# Altium project Twomes_Monitor_master.PrjPCB
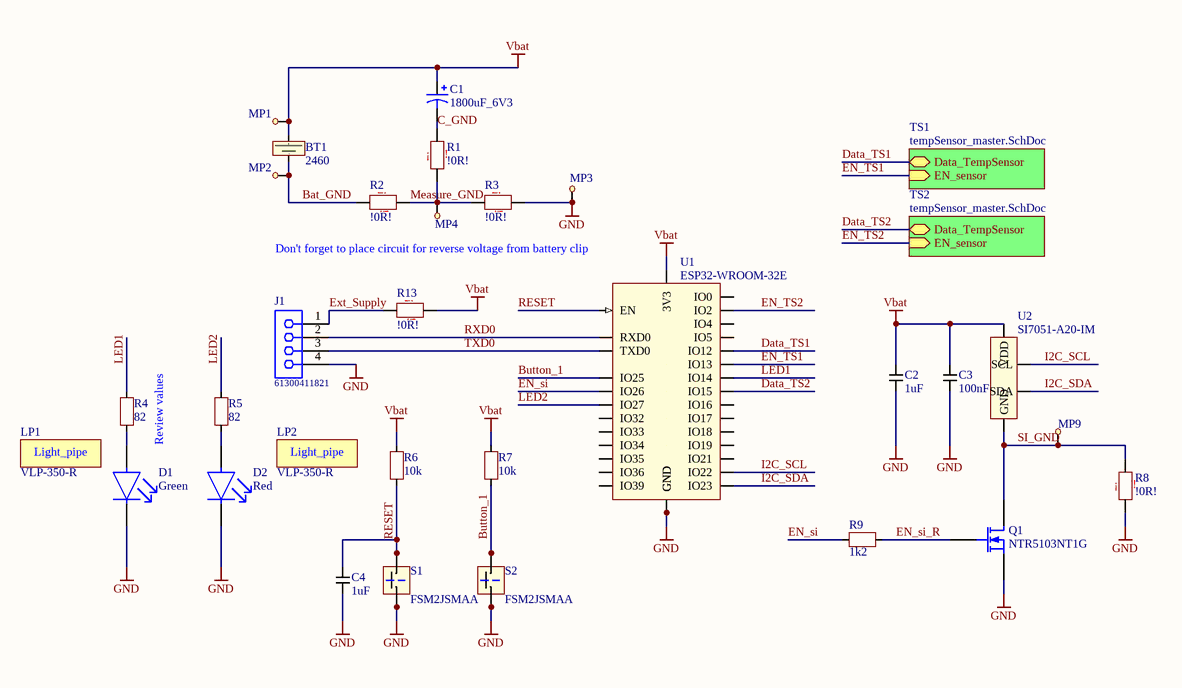
[diagram p0: main_master.SchDoc]
2 sheets, 44 parts. Net scope: hierarchical (ports join the sheet entries above them; power ports are global).
Board file: Twomes_Monitor_master.PcbDoc
Sheets:
  main_master.SchDoc
    TS1 = tempSensor_master.SchDoc
    TS2 = tempSensor_master.SchDoc

## Sheet main_master.SchDoc
size A4

### Parts
BT1  2460  [KEYSTONE_2410]
C1  1800uF_6V3  [CAPAE109103X105M]
C2  1uF  [C1206]
C3  100nF  [C1206]
C4  1uF  [C1206]
D1  Green  [Kingbright_KPT-2012EC_0]
D2  Red  [Kingbright_KPT-2012EC_0]
J1  61300411821  [61300411821]
LP1  VLP-350-R  [VLP-350-R]
LP2  VLP-350-R  [VLP-350-R]
MP1  Measure_point  [MeasurePoint_1.5mm]  (value not drawn)  (no BOM)
MP2  Measure_point  [MeasurePoint_1.5mm]  (value not drawn)  (no BOM)
MP3  Measure_point  [MeasurePoint_1.5mm]  (value not drawn)  (no BOM)
MP4  Measure_point  [MeasurePoint_1.5mm]  (value not drawn)  (no BOM)
MP9  Measure_point  [MeasurePoint_1.5mm]  (value not drawn)  (no BOM)
Q1  NTR5103NT1G  [SOT23]
R1  !0R!  [R1206_Simple-Assemble]  (no BOM)
R2  !0R!  [R1206_Simple-Assemble]  (no BOM)
R3  !0R!  [R1206_Simple-Assemble]  (no BOM)
R4  82  [R1206_Simple-Assemble]
R5  82  [R1206_Simple-Assemble]
R6  10k  [R1206_Simple-Assemble]
R7  10k  [R1206_Simple-Assemble]
R8  !0R!  [R1206_Simple-Assemble]  (no BOM)
R9  1k2  [R1206_Simple-Assemble]
R13  !0R!  [R1206_Simple-Assemble]  (no BOM)
S1  FSM2JSMAA  [FP-FSM2JSMAA-MFG]
S2  FSM2JSMAA  [FP-FSM2JSMAA-MFG]
U1  ESP32-WROOM-32E  [ESP32­WROOM­32E]
U2  SI7051-A20-IM  [3x3 6-pin DFN]

### Sub-sheets
TS1 = tempSensor_master.SchDoc: Data_TempSensor (bidir), EN_sensor (in)
TS2 = tempSensor_master.SchDoc: Data_TempSensor (bidir), EN_sensor (in)

### Nets
GND: C2.1 C3.1 C4.1 D1.1(C) D2.1(C) J1.4 MP3.1 Q1.2(S) R3.2 R8.1 S1.1(a) S1.3(c) S2.1(a) S2.3(c) U1.1(GND) U1.15(GND) U1.38(GND)
Vbat: BT1.1(+) C1.1 C2.2 C3.2 MP1.1 R6.2 R7.2 R13.2 U1.2(3V3) U2.5(VDD)
Bat_GND: BT1.2(-) MP2.1 R2.1
Button_1: R7.1 S2.2(b) S2.4(d) U1.10(IO25)
C_GND: C1.2 R1.2
Data_TS1: U1.14(IO12) ; sheet TS1/Data_TempSensor
Data_TS2: U1.23(IO15) ; sheet TS2/Data_TempSensor
EN_si: R9.1 U1.11(IO26)
EN_si_R: Q1.1(G) R9.2
EN_TS1: U1.16(IO13) ; sheet TS1/EN_sensor
EN_TS2: U1.24(IO2) ; sheet TS2/EN_sensor
Ext_Supply: J1.1 R13.1
I2C_SCL: U1.36(IO22) U2.6(SCL)
I2C_SDA: U1.37(IO23) U2.1(SDA)
LED1: R4.2 U1.13(IO14)
LED2: R5.2 U1.12(IO27)
Measure_GND: MP4.1 R1.1 R2.2 R3.1
RESET: C4.2 R6.1 S1.2(b) S1.4(d) U1.3(EN)
RXD0: J1.2 U1.34(RXD0)
SI_GND: MP9.1 Q1.3(D) R8.2 U2.2(GND)
TXD0: J1.3 U1.35(TXD0)
NetD1_2: D1.2(A) R4.1
NetD2_2: D2.2(A) R5.1

Not connected (* = marked no-connect by the designer): U1 4(IO36) 5(IO39) 6(IO34) 7(IO35) 8(IO32) 9(IO33) 17(NC) 18(NC) 19(NC) 20(NC) 21(NC) 22(NC) 25(IO0) 26(IO4) 27(IO16) 28(IO17) 29(IO5) 30(IO18) 31(IO19) 32(NC) 33(IO21)

### Notes on the sheet
- Don't forget to place circuit for reverse voltage from battery clip
- Review values
- (in symbol 0R, optional resistor) !
- (in symbol VLP-350-R) Light_pipe

### Library data of the parts
BT1 = 2460: Battery Holder, AA x 1, Through Hole; Brand: KEYSTONE; Farnell_Price: 1,80; Type: 2460; Farnell_Order_Code: 1702629; Mouser_Price: 1,10; Mouser_Order_Code: 534-2460
C1 = 1800uF_6V3: SMD Aluminium Electrolytic Capacitor, Radial Can, 1800 µF, 10 V, 0.092 ohm, TRV Series; Manufacturer Part Number: EEE-FN0J182UV; Manufacturer: Panasonic; Capacitance: 1.8mF; Voltage Rating: 10V; Value: 1800uF; Supplier Unit Price 1: €0.98708; Supplier Part Number 1: 667-EEE-FN0J182UV; Supplier 1: Mouser; Mount: Surface Mount; Category: Aluminum Electrolytic Capacitors
C2 C4 = 1uF,1206: 1uF, 1206; Capacitance: 1uF; Brand: *; Order Code: *; Type: *
C3 = 100nF,1206: 100nF, 1206; Capacitance: 100nF; Brand: *; Order Code: *; Type: *
D1 = AP2012MGC: Standard LEDs - SMD GRN WATER CLEAR 0805; Manufacturer: Kingbright; Forward Current: 20mA; Forward Voltage: 2.1V; Case/Package: 0805; Category: LEDs; Color: Green; Manufacturer Part Number: AP2012MGC; Supplier 1: Mouser; Supplier Part Number 1: 604-AP2012MGC
D2 = KPT-2012EC: KPT-2012EC -  LED, Low Power, Red, SMD, 0805 [2012 Metric], 30 mA, 2 V, 617 nm; Brand: KINGBRIGHT; Order Code: 2099236; Type: KPT-2012EC; Supplier: Farnell; Price: 0,112
J1 = 61300411821: THT Vertical Socket Header WR-PHD, Pitch 2.54 mm, Single Row, 4 pins; Pin Number: 4; Pitch: 2.54 mm; Gender: Female; Rated Current: 3 A; Working Voltage: 250 VAC; Withstanding Voltage: 500 VAC; Contact Resistance: 20 mOhm; ComponentLink1Description: Manufacturer; ComponentLink1URL: http://www.we-online.de; ComponentLink2Description: Datasheet; ComponentLink2URL: https://katalog.we-online.de/em/datasheet/6130xx11821.pdf; Part Number: 61300411821; Published Date: August 2018; Publisher: Wurth Elektronik; Operating Temperature: -40 to 125 degC; Mounting Technology: THT; Packaging: Tray; Row Number: Single; Orientation: Vertical
LP1 LP2 = VLP-350-R: LIGHT PIPE, SINGLE, ROUND, PCB; Manufacturer: BIVAR; Manufacturer Part Number: VLP-350-R
MP1-MP4 MP9 = Measure_point: Measurepoint
Q1 = NTR5103NT1G: Power MOSFET, N Channel, 60 V, 260 mA, 1 ohm, SOT-23, Surface Mount; Manufacturer: ON Semiconductor; Manufacturer Part Number: NTR5103NT1G
R1-R3 R8 R13 = 0R, optional resistor: normally shorted, but easy to change to an resistor footprint
R4 R5 = 82, 1206: Brand: MULTICOMP; Resistance: 82; Supplier: Farnell
R6 R7 = 10k, 1206: 10k, 1206, 250mW, 200V; Brand: TE CONNECTIVITY; Order Code: 2861956; Resistance: 10k; Power: 250mW; Type: CRGCQ1206J10K; Supplier: Farnell; Price: 0,0139
R9 = 1k2, 1206: SMD Chip Resistor, 1206 [3216 Metric], 1 kohm, MCSR 12 Series, 200 V, Ceramic, 250 mW; Brand: MULTICOMP; Order Code: 2446791; Power: 250mW; Resistance: 1k2; Type: MCWR12X1201FTL; Supplier: Farnell; Price: 0,0298
S1 S2 = FSM2JSMAA: Tactile Switch, FSMJSM Series, Top Actuated, Surface Mount, Round Button, 260 gf, 50mA at 24VDC; Manufacturer: TE Connectivity; Connector Type: SMD/SMT; Voltage Rating (DC): 24V; Supplier Unit Price 1: €0.13022; Mount: Surface Mount; Manufacturer Part Number: FSM2JSMAA; Category: Pushbutton Switches; Case/Package: SMD/SMT
U1 = ESP32-WROOM-32E(M113EH2800PH3Q0): USB-modules (802.11) SMD Module ESP32-WROOM-32E, ESP32-D0WD-V3, 16 MB SPI flash, PCB antenna; Brand: Espressif Systems; Order Code: 356-ESP32WRM32E128PH; Type: ESP32-WROOM-32E; Price: 2,64; Supplier: MOUSER
U2 = SI7051-A20-IM: Temperature Sensor IC, Digital, ± 0.1°C, -40 °C, 125 °C, DFN, 6 Pins; Brand: SILICON LABS; Order Code: 2769160; Type: SI7051-A20-IM; Price: 1,98; Supplier: Farnell; ClassName: Smallpitch

## Sheet tempSensor_master.SchDoc
size A4
Used 2 times, as channels TS1, TS2. Parts and nets are listed once, with the designators drawn on the sheet.
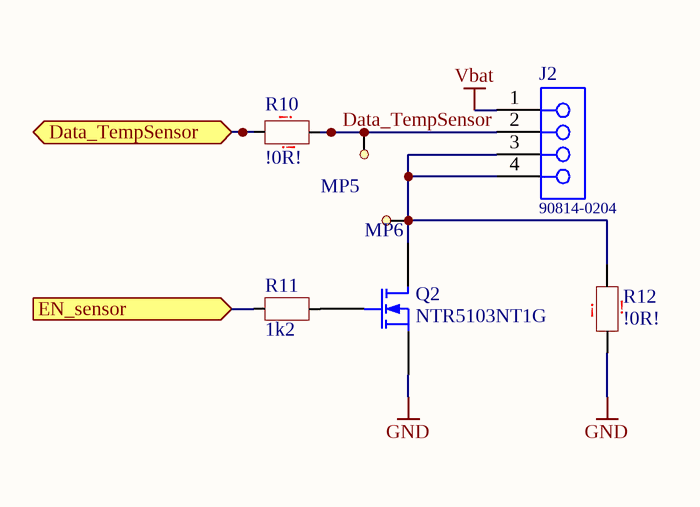
[diagram p1: tempSensor_master.SchDoc]

### Parts
J2  90814-0204  [MOLEX_90814-0204]
MP5  Measure_point  [MeasurePoint_1.5mm]  (value not drawn)  (no BOM)
MP6  Measure_point  [MeasurePoint_1.5mm]  (value not drawn)  (no BOM)
Q2  NTR5103NT1G  [SOT23]
R10  !0R!  [R1206_Simple-Assemble]  (no BOM)
R11  1k2  [R1206_Simple-Assemble]
R12  !0R!  [R1206_Simple-Assemble]  (no BOM)

### Ports
Data_TempSensor (bidir), EN_sensor (in)

### Nets
GND: Q2.2(S) R12.1
Vbat: J2.1
Data_TempSensor: J2.2 MP5.1 R10.2
Data_TempSensor: R10.1 ; port Data_TempSensor  [a separate net that carries the same name]
EN_sensor: R11.1 ; port EN_sensor
NetJ2_3: J2.3 J2.4 MP6.1 Q2.3(D) R12.2
NetQ2_1: Q2.1(G) R11.2

### Channels
TS1: designators end in _TS1; ports Data_TempSensor=Data_TS1 EN_sensor=EN_TS1
TS2: designators end in _TS2; ports Data_TempSensor=Data_TS2 EN_sensor=EN_TS2

### Notes on the sheet
- (in symbol 0R, optional resistor) !

### Library data of the parts
J2 = 90814-0204: Pin Header, Signal, 1.27 mm, 1 Rows, 4 Contacts, Surface Mount Straight, Picoflex 90814 Series; Manufacturer: MOLEX; Manufacturer Part Number: 90814-0204
MP5 MP6 = Measure_point: Measurepoint
Q2 = NTR5103NT1G: as Q1 on sheet main_master; Manufacturer Part Number: NTR5103NT1G
R10 R12 = 0R, optional resistor: as R1 on sheet main_master
R11 = 1k2, 1206: as R9 on sheet main_master; Resistance: 1k2; Type: MCWR12X1201FTL; Supplier: Farnell; Price: 0,0298

## Nets that join several sheets
GND: main_master (17 pins), TS1 (Q2_TS1.2 R12_TS1.1), TS2 (Q2_TS2.2 R12_TS2.1)
Vbat: main_master (10 pins), TS1 (J2_TS1.1), TS2 (J2_TS2.1)
Data_TS1: main_master (U1.14), TS1 (R10_TS1.1)
Data_TS2: main_master (U1.23), TS2 (R10_TS2.1)
EN_TS1: main_master (U1.16), TS1 (R11_TS1.1)
EN_TS2: main_master (U1.24), TS2 (R11_TS2.1)

## Assembly variants
Boiler_Node_Always_On_Sensors: not fitted C2 C3 Q1 Q2_TS1 Q2_TS2 R8 R9 R11_TS1 R11_TS2 U2
Room_Node: not fitted J2_TS1 J2_TS2 Q2_TS1 Q2_TS2 R10_TS1 R10_TS2 R11_TS1 R11_TS2 R12_TS1 R12_TS2
Boiler_Node_Switched_Sensors: not fitted C2 C3 Q1 R8 R9 R12_TS1 R12_TS2 U2